# Altium schematic sheet PAGE1 - CONTENTS.SchDoc
size A3; DocumentNumber: 1; SheetNumber: 1; SheetTotal: 4
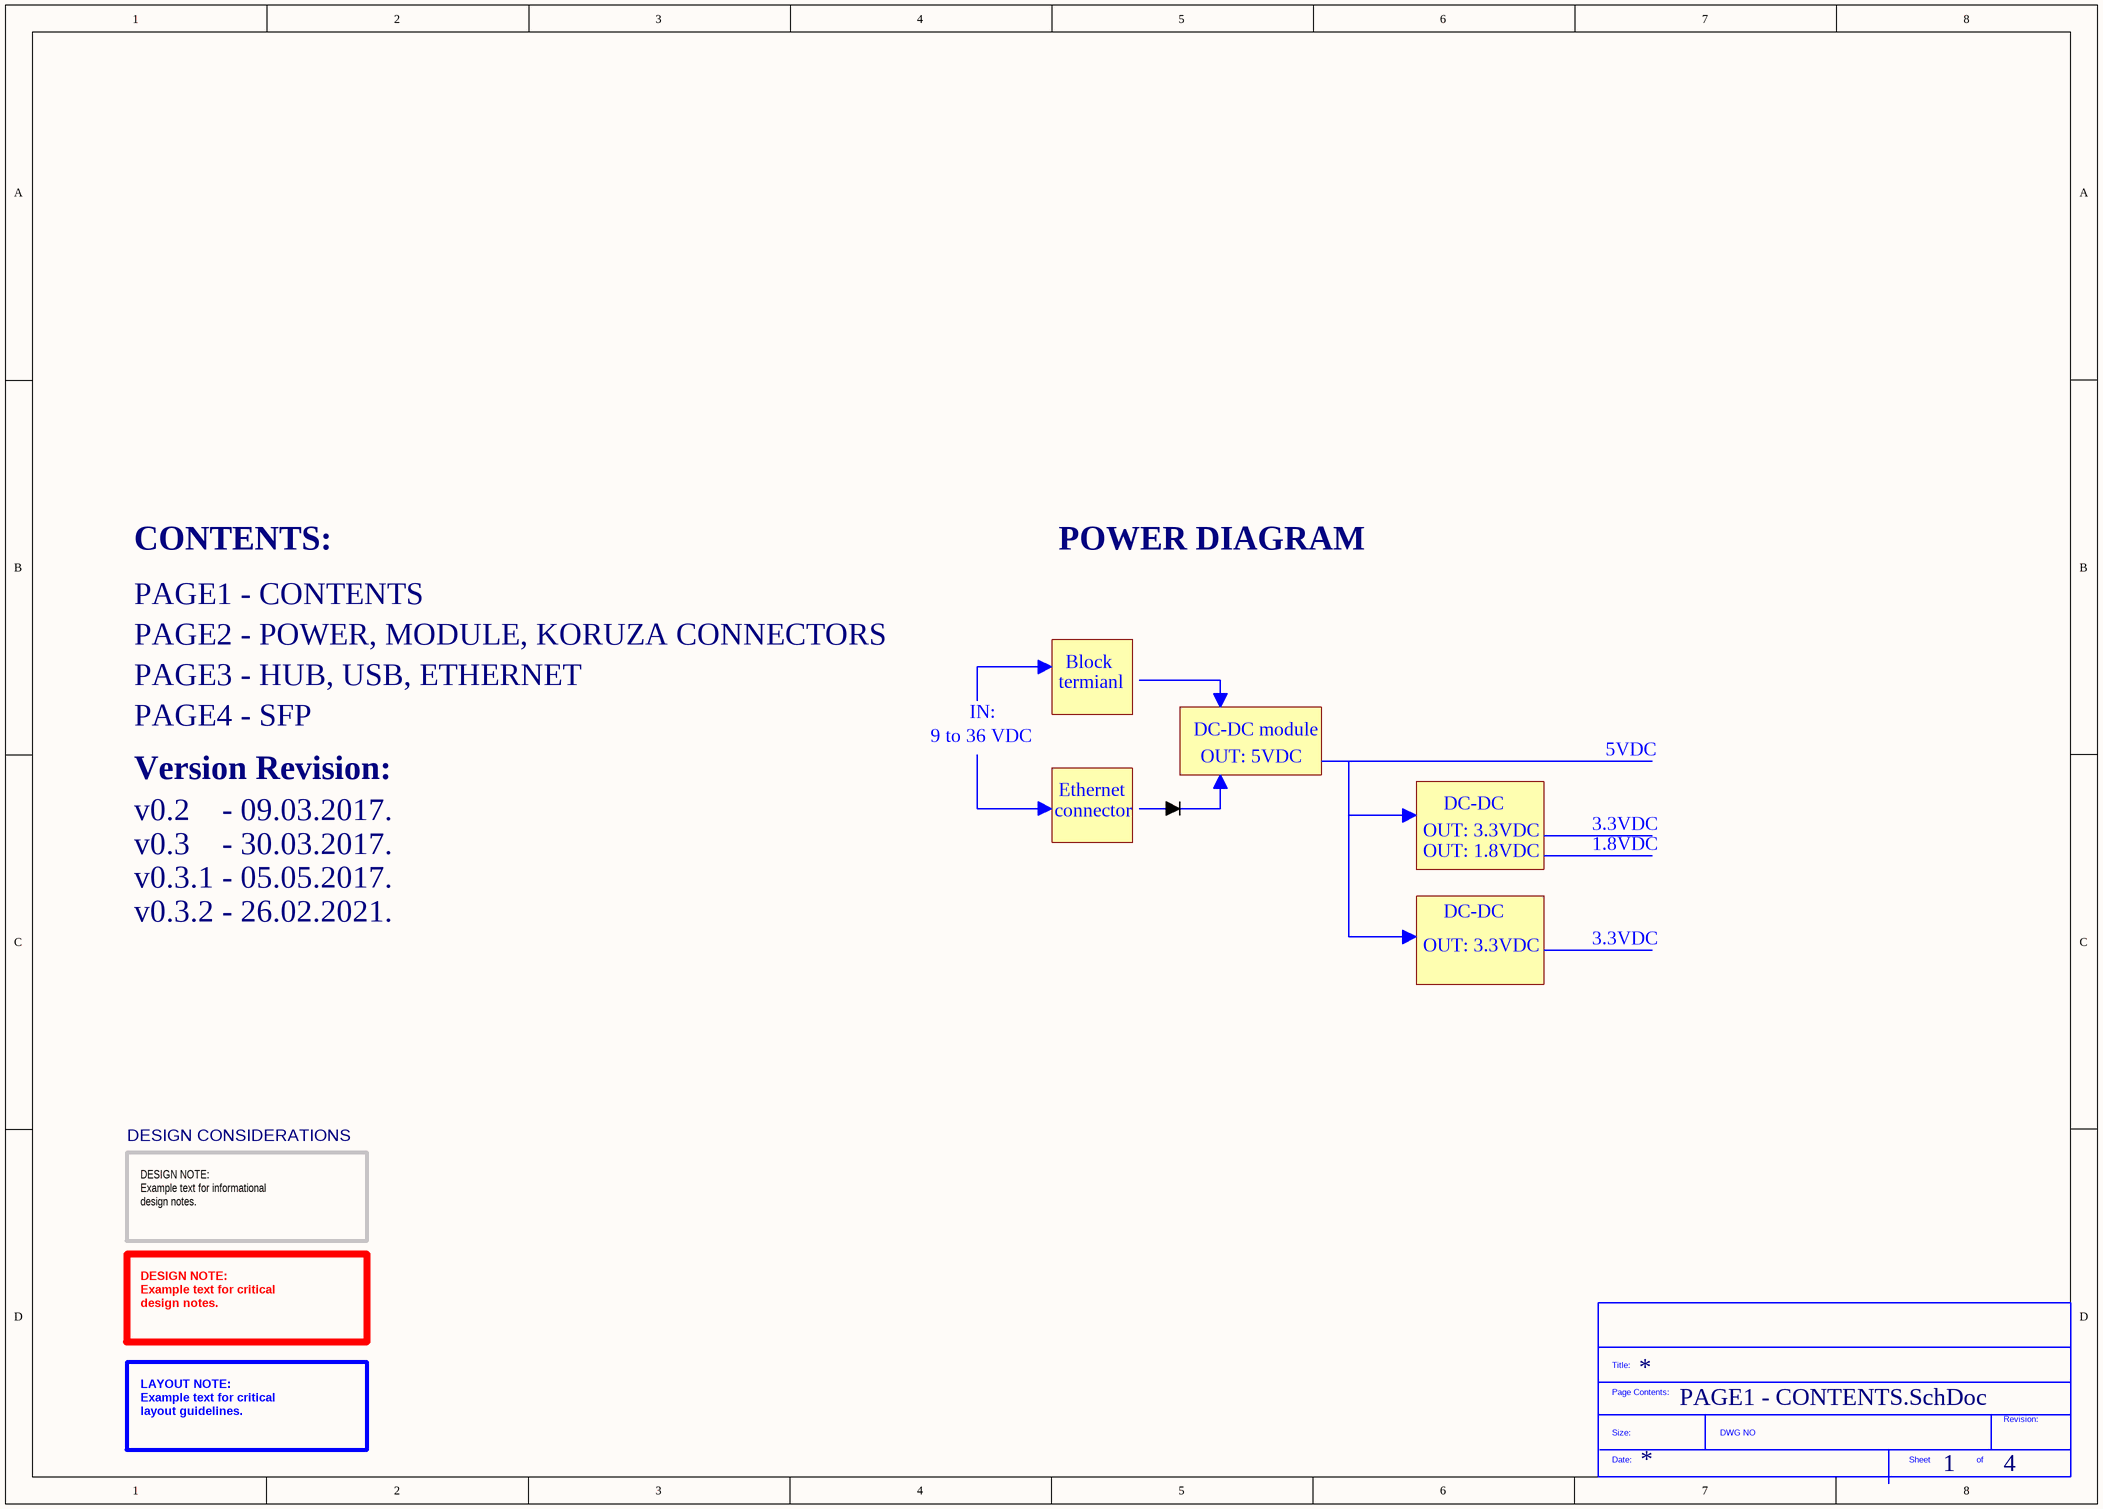
[diagram p0: PAGE1 - CONTENTS.SchDoc]

## Parts
*?  SDTitleBlock  (value not drawn)  (graphical)

## Notes on the sheet
- CONTENTS:
- POWER DIAGRAM
- PAGE1 - CONTENTS
- PAGE2 - POWER, MODULE, KORUZA CONNECTORS
- PAGE3 - HUB, USB, ETHERNET
- IN:
- termianl
- Block
- Version Revision:
- PAGE4 - SFP
- 9 to 36 VDC
- DC-DC module
- OUT: 5VDC
- 5VDC
- v0.2    - 09.03.2017.
- v0.3    - 30.03.2017.
- connector
- Ethernet
- OUT: 3.3VDC
- OUT: 1.8VDC
- DC-DC
- 3.3VDC
- 1.8VDC
- v0.3.1 - 05.05.2017.
- v0.3.2 - 26.02.2021.
- DESIGN CONSIDERATIONS
- DESIGN NOTE:
  Example text for informational
  design notes.
- DESIGN NOTE:
  Example text for critical
  design notes.
- LAYOUT NOTE:
  Example text for critical
  layout guidelines.
- (in symbol SDTitleBlock) Title:; Page Contents:; Revision:; Size:; DWG NO; Date:; Sheet; of